# EAGLE schematic enable (EAGLE 6.5.0)
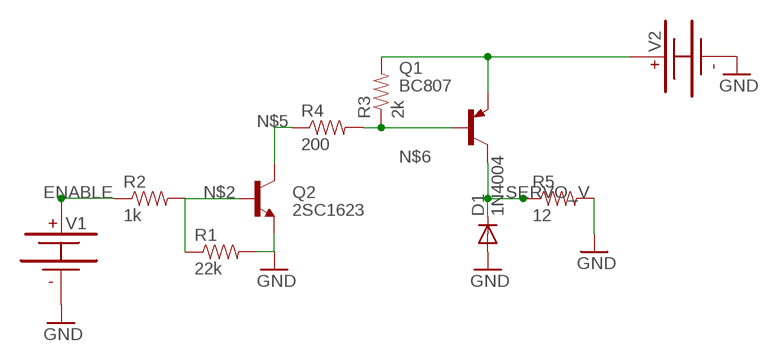
[diagram p0: schematic, sheet 1]

## Parts
D1  1N4004  DIODE_DIODE-C221B1A  [DIODE_C221B1A]
Q1  BC807  -PNP-SOT23-BCE  [SOT23-BCE]
Q2  2SC1623  TRANSISTOR_NPNSOT23  [SOT23]
R1  22k  RESISTOR0603-RES  [0603-RES]
R2  1k  RESISTOR0603-RES  [0603-RES]
R3  2k  RESISTOR0603-RES  [0603-RES]
R4  200  RESISTOR0603-RES  [0603-RES]
R5  12  RESISTOR0603-RES  [0603-RES]
V1  VSOURCE  [VSOURCE]
V2  VSOURCE  [VSOURCE]

## Nets
ENABLE: R2.1 V1.1
GND: D1.A Q2.2(E) R1.2 R5.2 V1.2 V2.2
N$2: Q2.1(B) R1.1 R2.2
N$3: Q1.E R3.2 V2.1
N$5: Q2.3(C) R4.1
N$6: Q1.B R3.1 R4.2
SERVO_V: D1.C Q1.C R5.1

## Library data of the parts
D1 = Arduino_MEGA2560_ref:DIODE_DIODE-: DIODE
Q1 = transistor:*-PNP-: PNP Transistror
Q2 = SparkFun:TRANSISTOR_NPN: Transistor NPN BJT configuration in SOT23 package. MMBT2222 is the common NPN we use. Double check BCE configuration again layout.
R1-R5 = SparkFun:RESISTOR: Resistor Basic schematic elements and footprints for 0603, 1206, and PTH resistors.
V1 V2 = SPICE:VSOURCE